# Altium schematic sheet Solenoid_Valve_Protection.SchDoc
size A4
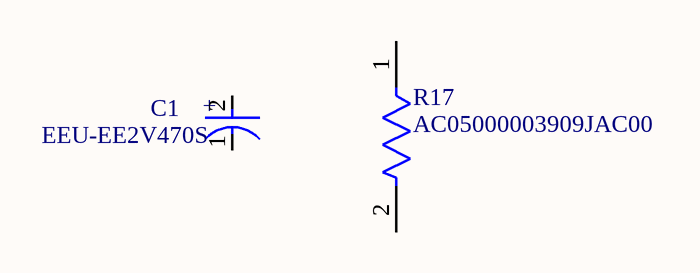
[diagram p0: Solenoid_Valve_Protection.SchDoc]

## Parts
C1  EEU-EE2V470S  [FP-EE18-MFG]
R17  AC05000003909JAC00  [FP-AC05000003909JAC00-0]

## Nets

Not connected (* = marked no-connect by the designer): C1 1(C) 2(A); R17 1 2

## Notes on the sheet
- (in symbol CMP-05427-000016-1) +

## Library data of the parts
C1 = CMP-05427-000016-1: CAP ALUM 47UF 20% 350V RADIAL; Manufacturer: Panasonic Electronic Components; Life: 10000Hours; Leakage Current: 997uA; Ripple Current: 1070mA; Material: Aluminum; Digikey Description: CAP ALUM 47UF 20% 350V RADIAL; Temperature Range Low: -25°C; Octopart: https://octopart.com/eeuee2v470s-panasonic-8718008; Ipc Land Pattern Name: CAPRD750W100D1850H2000; Automotive: No; Voltage Rating: 350V; ComponentLink2URL: https://industrial.panasonic.com/cdbs/www-data/pdf/RDF0000/ABA0000C1026.pdf; RoHS: TRUE; Manufacturer Part Number: EEU-EE2V470S; Lead Free: Yes; Dissipation Factor: 20%; Height: 22mm; Tolerance: 20%; Device Class L1: Passive Components; Device Class L2: Capacitors; Value: 47uF; ComponentLink2Description: Datasheet; Temperature Range High: +105°C; Device Class L3: Aluminum Electrolytic Capacitors; Temperature: -25°C to +105°C; Category: Cap; Package: EE18; Capacitance: 47uF; Mouser Description: Aluminum Electrolytic Capacitors - Leaded 47uF 350volts AEC-Q200
R17 = CMP-02408-000001-1: RES 39 OHM 5W 5% AXIAL; Manufacturer: Vishay; Value: 39Ω; Automotive Grade: NA; Device Class L2: Resistors; Automotive: No; Device Class L3: Through-Hole Resistors; Lead Free: Yes; Octopart: https://octopart.com/ac05000003909jac00-vishay-39746279; Tolerance: 5%; Temperature Range High: +250°C; Manufacturer Part Number: AC05000003909JAC00; Power Rating: 5W; Package: 0; Category: Res; Digikey Description: RES 39 OHM 5W 5% AXIAL; RoHS: TRUE; Height: 7.5mm; Mouser Description: Res Wirewound 39 Ohm 5% 5W -80ppm/°C to -10ppm/°C Conformal AXL Thru-Hole Ammo Pack; Resistance: 39Ω; Temperature: -55°C to +250°C; Device Class L1: Passive Components; ComponentLink2URL: http://www.vishay.com/docs/28730/acac-at.pdf; Composition: Wirewound; ComponentLink2Description: Datasheet; Temperature Range Low: -55°C; Series: AC; Ipc Land Pattern Name: RESAD2166W100L1800D750